# Altium schematic sheet LoRa.SchDoc: Наименование
size 209 x 297 mm; ApprovedBy: Утвердил; CheckedBy: Проверил; Author: Разработал; CompanyName: Организация; DrawnBy: Н.Контр; Engineer: Т.Контр; SheetNumber: 4; SheetTotal: 5; PageSetup: Record=PageOptions|CenterHorizontal=True|CenterVertical=True|PrintScale=0.94|XCorrection=1.00|YCorrection=1.00|PrintKind=1|BorderSize=5000000|LeftOffset=0|BottomOffset=0|Orientation=1|PaperLength=1000|PaperWidth=1000|Scale=100|PaperSource=7|PrintQuality=-4|MediaType=1|DitherType=10|PaperKind=A4|PrintScaleMode=1; DecimalNumber: Децимальный номер; HeadOfSector: Нач. сектора; MainDevice: Перв.примен.; Name: Наименование; DocumentName: Sheet1.SCHDOC
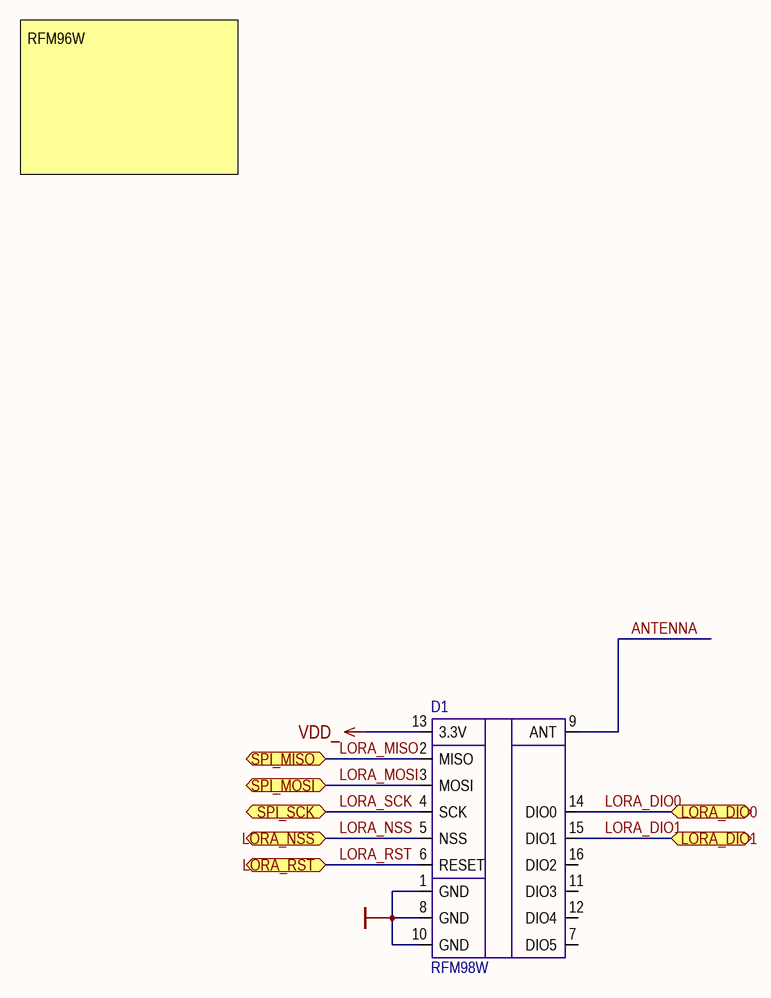
[diagram p0: LoRa.SchDoc]

## Parts
D1  RFM98W  [RFM98W]

## Ports
LORA_DIO0 (bidir), LORA_DIO1 (bidir), LORA_NSS (bidir), LORA_RST (bidir), SPI_MISO (bidir), SPI_MOSI (bidir), SPI_SCK (bidir)

## Nets
GND: D1.1(GND) D1.8(GND) D1.10(GND)
VDD_: D1.13(3.3V)
ANTENNA: D1.9(ANT)
LORA_DIO0: D1.14(DIO0) ; port LORA_DIO0
LORA_DIO1: D1.15(DIO1) ; port LORA_DIO1
LORA_MISO: D1.2(MISO) ; port SPI_MISO
LORA_MOSI: D1.3(MOSI) ; port SPI_MOSI
LORA_NSS: D1.5(NSS) ; port LORA_NSS
LORA_RST: D1.6(RESET) ; port LORA_RST
LORA_SCK: D1.4(SCK) ; port SPI_SCK

Not connected (* = marked no-connect by the designer): D1 7(DIO5) 11(DIO3) 12(DIO4) 16(DIO2)

## Notes on the sheet
- RFM96W
- Подп. и дата
- Инв.№ дубл.
- Взам.инв.№
- Подп.и дата
- Инв.№ подл.
- Изм.
- Лист
- № докум.
- Подп.
- Дата
- Формат  A4

## Library data of the parts
D1 = RFM98W: LoRa modem